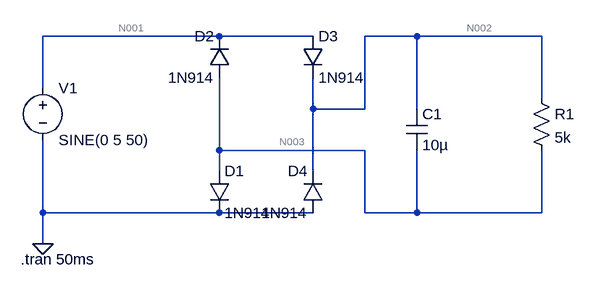
[diagram p0: schematic vipramlach2.asc]
vipramlach2.asc, the LTspice schematic file:
Version 4
SHEET 1 1016 680
WIRE 288 48 16 48
WIRE 432 48 288 48
WIRE 592 48 512 48
WIRE 784 48 592 48
WIRE 16 128 16 48
WIRE 784 144 784 48
WIRE 432 160 432 112
WIRE 512 160 512 48
WIRE 512 160 432 160
WIRE 592 160 592 48
WIRE 288 224 288 112
WIRE 512 224 288 224
WIRE 288 256 288 224
WIRE 432 256 432 160
WIRE 16 320 16 208
WIRE 288 320 16 320
WIRE 432 320 288 320
WIRE 512 320 512 224
WIRE 592 320 592 224
WIRE 592 320 512 320
WIRE 784 320 784 224
WIRE 784 320 592 320
WIRE 16 368 16 320
FLAG 16 368 0
SYMBOL voltage 16 112 R0
WINDOW 123 0 0 Left 2
WINDOW 39 0 0 Left 2
SYMATTR InstName V1
SYMATTR Value SINE(0 5 50)
SYMBOL diode 272 256 R0
SYMATTR InstName D1
SYMATTR Value 1N914
SYMBOL diode 304 112 R180
WINDOW 0 24 64 Left 2
WINDOW 3 24 0 Left 2
SYMATTR InstName D2
SYMATTR Value 1N914
SYMBOL diode 416 48 R0
SYMATTR InstName D3
SYMATTR Value 1N914
SYMBOL diode 448 320 R180
WINDOW 0 24 64 Left 2
WINDOW 3 24 0 Left 2
SYMATTR InstName D4
SYMATTR Value 1N914
SYMBOL cap 576 160 R0
SYMATTR InstName C1
SYMATTR Value 10µ
SYMBOL res 768 128 R0
SYMATTR InstName R1
SYMATTR Value 5k
TEXT -18 392 Left 2 !.tran 50ms

The netlist it stands for:
* vipramlach2.asc
V1 N001 0 SINE(0 5 50)
D1 N003 0 1N914
D2 N003 N001 1N914
D3 N001 N002 1N914
D4 0 N002 1N914
C1 N002 N003 10µ
R1 N002 N003 5k
.model D D
.lib standard.dio
.tran 50ms
.backanno
.end

* Results of the author's LTspice run, read from the files saved beside the schematic
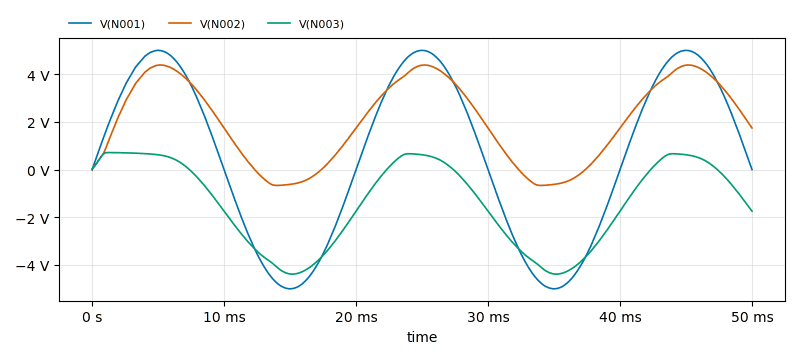
[diagram p1: Transient Analysis of vipramlach2.asc, plotted from the saved traces]
* Transient Analysis, 1 run:
*   V(N001): min -5 V, max 5 V, average 635.6 mV, rms 3.539 V, last 0 V
*   V(N002): min -664.5 mV, max 4.385 V, average 2.011 V, rms 2.667 V, last 1.743 V
*   V(N003): min -4.385 V, max 713.8 mV, average -1.376 V, rms 2.261 V, last -1.743 V